# EAGLE design BusPirate-v3.6a-LTS-placed4-plane2-final (EAGLE 6.5.0)
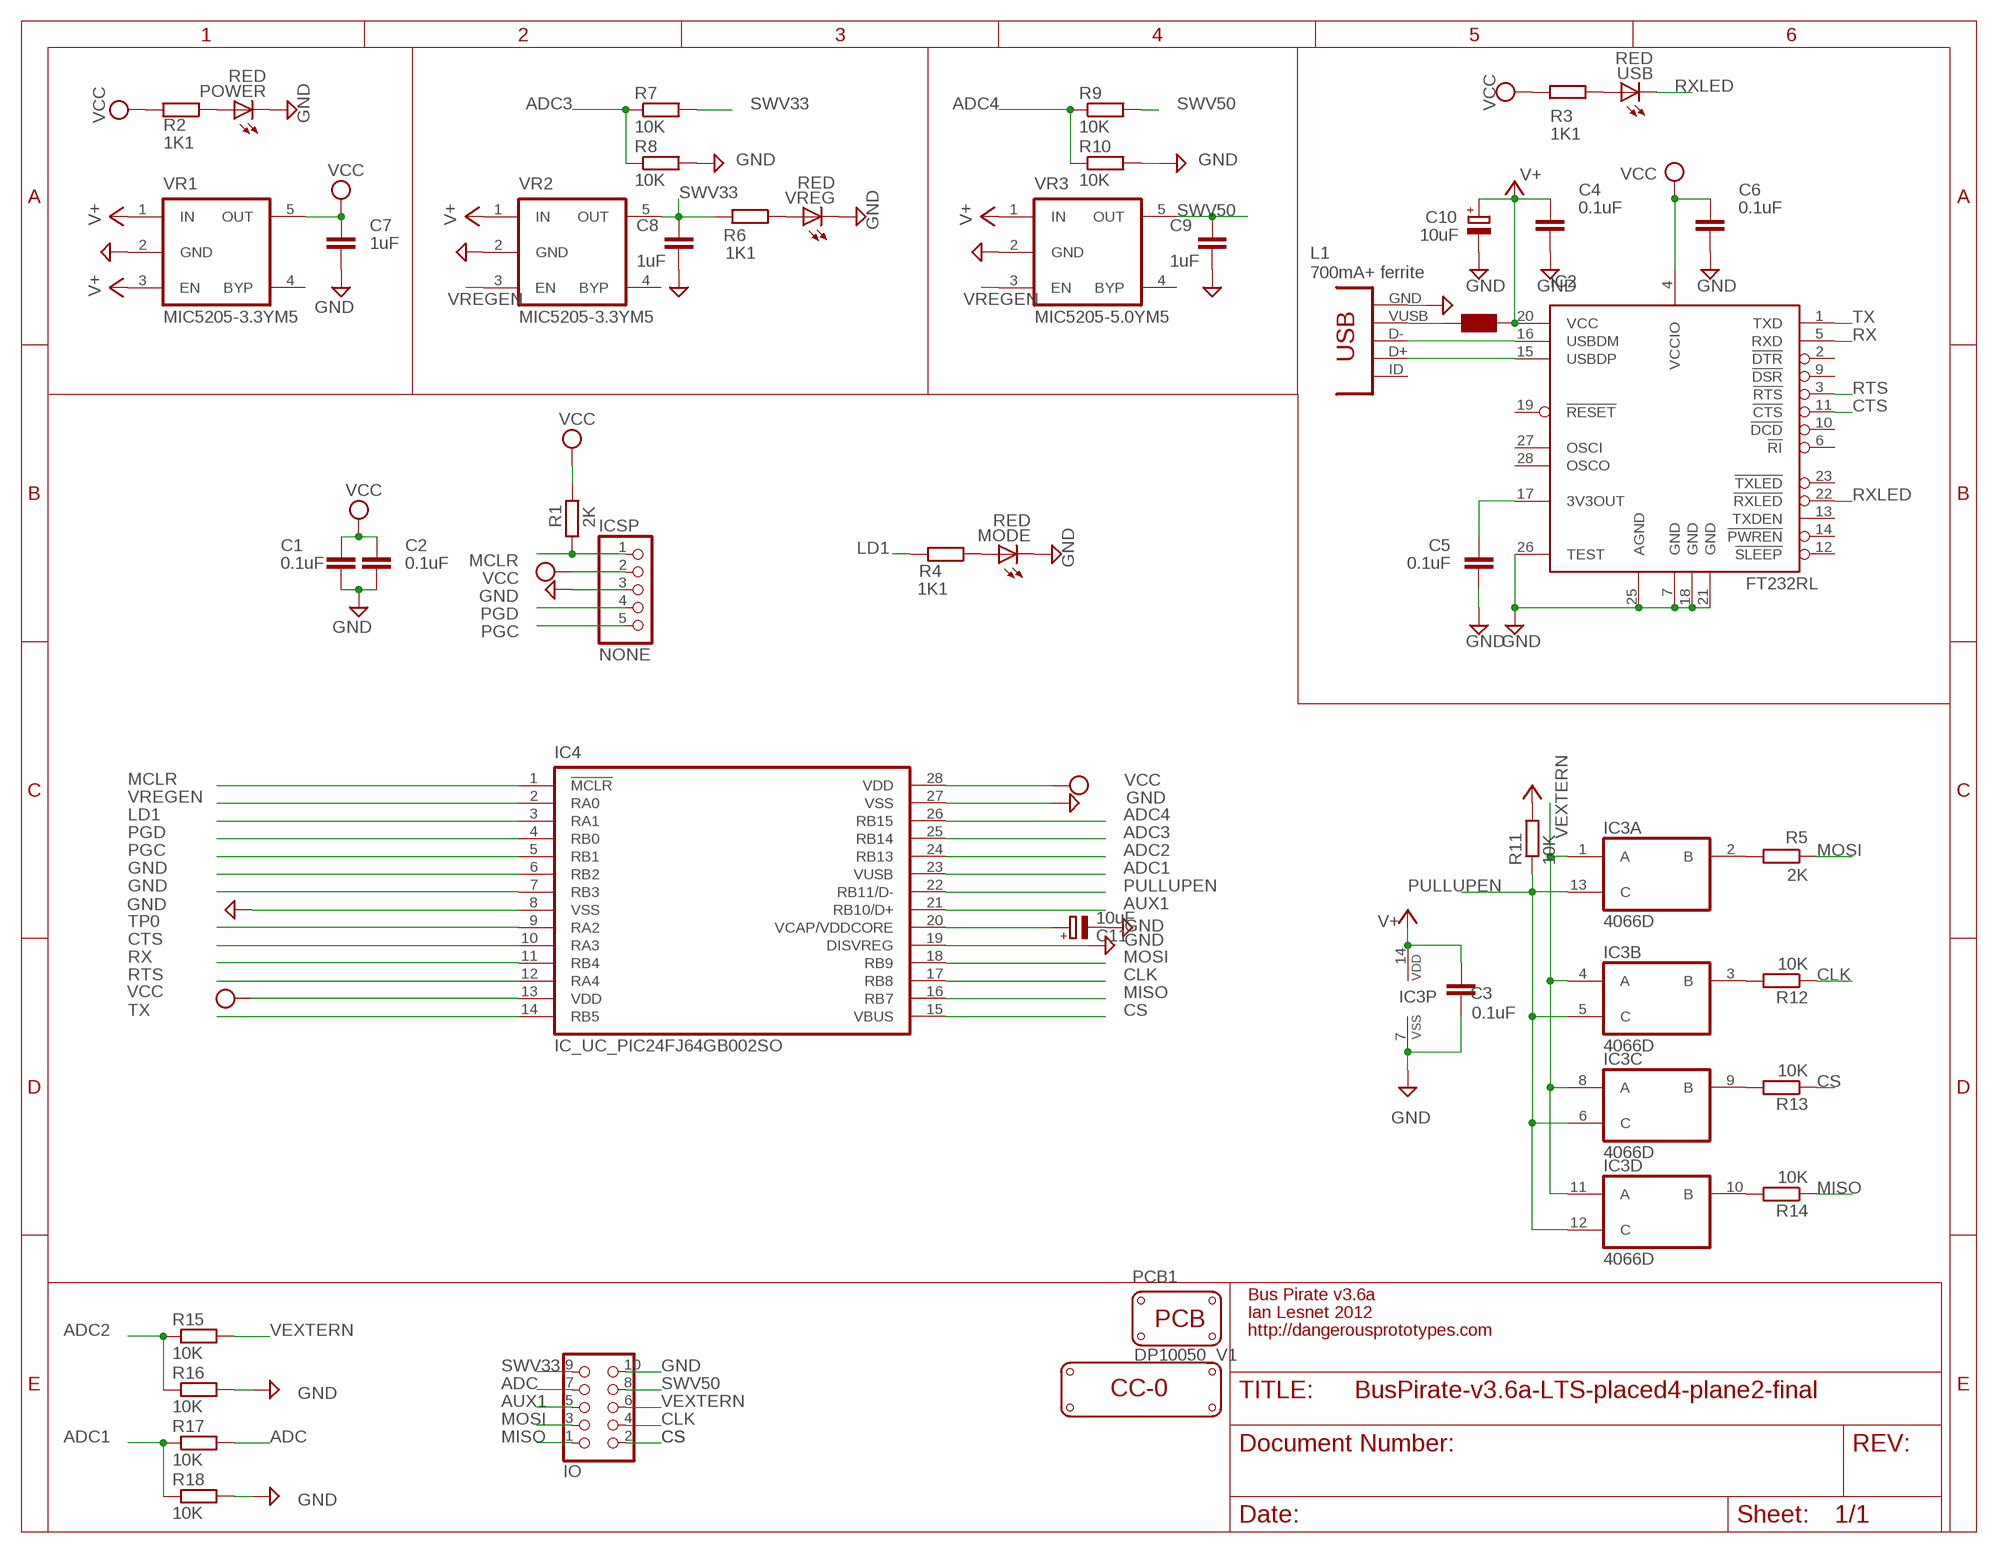
[diagram p0: schematic, sheet 1]

## Parts
C1  0.1uF  C-EUC1206  [C1206]
C2  0.1uF  C-EUC1206  [C1206]
C3  0.1uF  C-EUC1206  [C1206]
C4  0.1uF  C-EUC1206  [C1206]
C5  0.1uF  C-EUC1206  [C1206]
C6  0.1uF  C-EUC1206  [C1206]
C7  1uF  C-EUC1206  [C1206]
C8  1uF  C-EUC1206  [C1206]
C9  1uF  C-EUC1206  [C1206]
C10  10uF  CPOL-EUCT3528  [CT3528]
C11  10uF  CPOL-EUCT3528  [CT3528]
IC2  FT232RL  [SSOP28]
IC3  4066D  [SO14]
IC4  IC_UC_PIC24FJ64GB002SO  [SOIC-28W]
ICSP  NONE  PINHD-1X5  [1X05]
IO  CON_HEADER_2X05-PTH+SHROUDED_B  [PINSHRD_PTH_2X05B]
J1  CON-USB-MINI-BUSB1  [CONN_USB_MINI-B]
L1  700mA+ ferrite  WE-KIL_0805  [WE-KI_0805_B]
LOGO1  LOGO_CC-0  [LOGO_CC-0]
MODE  RED  LEDCHIPLED_1206  [CHIPLED_1206]
PCB1  PCB_DP_RECTANGLE-50X100  [DP10050_V1]
POWER  RED  LEDCHIPLED_1206  [CHIPLED_1206]
R1  2K  R-EU_R1206  [R1206]
R2  1K1  R-EU_R1206  [R1206]
R3  1K1  R-EU_R1206  [R1206]
R4  1K1  R-EU_R1206  [R1206]
R5  2K  R-EU_R1206  [R1206]
R6  1K1  R-EU_R1206  [R1206]
R7  10K  R-EU_R1206  [R1206]
R8  10K  R-EU_R1206  [R1206]
R9  10K  R-EU_R1206  [R1206]
R10  10K  R-EU_R1206  [R1206]
R11  10K  R-EU_R1206  [R1206]
R12  10K  R-EU_R1206  [R1206]
R13  10K  R-EU_R1206  [R1206]
R14  10K  R-EU_R1206  [R1206]
R15  10K  R-EU_R1206  [R1206]
R16  10K  R-EU_R1206  [R1206]
R17  10K  R-EU_R1206  [R1206]
R18  10K  R-EU_R1206  [R1206]
USB  RED  LEDCHIPLED_1206  [CHIPLED_1206]
VR1  MIC5205-3.3YM5  MIC5205  [SOT-23-5]
VR2  MIC5205-3.3YM5  MIC5205  [SOT-23-5]
VR3  MIC5205-5.0YM5  MIC5205  [SOT-23-5]
VREG  RED  LEDCHIPLED_1206  [CHIPLED_1206]

## Nets
$N26: J1.VUSB L1.2
ADC: IO.7 R17.2
ADC1: IC4.23(VUSB) R17.1 R18.1
ADC2: IC4.24(RB13) R15.1 R16.1
ADC3: IC4.25(RB14) R7.1 R8.1
ADC4: IC4.26(RB15) R9.1 R10.1
AUX1: IC4.21(RB10/D+) IO.5
CLK: IC4.17(RB8) IO.4 R12.1
CS: IC4.15(VBUS) IO.2 R13.1
CTS: IC2.11(!CTS) IC4.10(RA3)
GND: C1.2 C2.2 C3.2 C4.2 C5.2 C6.2 C7.2 C8.2 C9.2 C10.- C11.- IC2.7(GND) IC2.18(GND) IC2.21(GND) IC2.25(AGND) IC2.26(TEST) IC3.7(P:VSS) IC4.6(RB2) IC4.7(RB3) IC4.8(VSS) IC4.19(DISVREG) IC4.27(VSS) ICSP.3 IO.10 J1.GND MODE.C POWER.C R8.2 R10.2 R16.2 R18.2 VR1.2(GND) VR2.2(GND) VR3.2(GND) VREG.C
LD1: IC4.3(RA1) R4.2
MCLR: IC4.1(!MCLR) ICSP.1 R1.1
MISO: IC4.16(RB7) IO.1 R14.1
MOSI: IC4.18(RB9) IO.3 R5.1
N$1: IC3.2(A:B) R5.2
N$2: IC3.3(B:B) R12.2
N$3: C11.+ IC4.20(VCAP/VDDCORE)
N$4: IC3.9(C:B) R13.2
N$5: IC3.10(D:B) R14.2
N$6: MODE.A R4.1
N$7: POWER.A R2.1
N$9: C5.1 IC2.17(3V3OUT)
N$13: R3.1 USB.A
N$15: IC2.15(USBDP) J1.D+
N$16: IC2.16(USBDM) J1.D-
N$18: R6.1 VREG.A
PGC: IC4.5(RB1) ICSP.5
PGD: IC4.4(RB0) ICSP.4
PULLUPEN: IC3.5(B:C) IC3.6(C:C) IC3.12(D:C) IC3.13(A:C) IC4.22(RB11/D-) R11.1
RTS: IC2.3(!RTS) IC4.12(RA4)
RX: IC2.5(RXD) IC4.11(RB4)
RXLED: IC2.22(!RXLED) USB.C
SWV33: C8.1 IO.9 R6.2 R7.2 VR2.5(OUT)
SWV50: C9.1 IO.8 R9.2 VR3.5(OUT)
TP0: IC4.9(RA2)
TX: IC2.1(TXD) IC4.14(RB5)
V+: C3.1 C4.1 C10.+ IC2.20(VCC) IC3.14(P:VDD) L1.1 R11.2 VR1.1(IN) VR1.3(EN) VR2.1(IN) VR3.1(IN)
VCC: C1.1 C2.1 C6.1 C7.1 IC2.4(VCCIO) IC4.13(VDD) IC4.28(VDD) ICSP.2 R1.2 R2.2 R3.2 VR1.5(OUT)
VEXTERN: IC3.1(A:A) IC3.4(B:A) IC3.8(C:A) IC3.11(D:A) IO.6 R15.2
VREGEN: IC4.2(RA0) VR2.3(EN) VR3.3(EN)
Unconnected: IC2.2(!DTR) IC2.6(!RI) IC2.9(!DSR) IC2.10(!DCD) IC2.12(!SLEEP) IC2.13(TXDEN) IC2.14(!PWREN) IC2.19(!RESET) IC2.23(!TXLED) IC2.27(OSCI) IC2.28(OSCO) J1.BODY@1(BODY) J1.BODY@2(BODY) J1.BODY@3(BODY) J1.BODY@4(BODY) J1.ID(USBID) VR1.4(BYP) VR2.4(BYP) VR3.4(BYP)

## Notes on the sheet
- Bus Pirate v3.6a
- Ian Lesnet 2012
- http://dangerousprototypes.com

## Library data of the parts
C1-C9 = rcl:C-EU: CAPACITOR, European symbol
C10 C11 = rcl:CPOL-EU: POLARIZED CAPACITOR, European symbol
IC2 = dp_devices:FT232RL: USB to serial UART interface
IC3 = 40xx:4066: Quad bilateral ANALOG SWITCH
IC4 = dp_devices:IC_UC_PIC24FJ64GB002
ICSP = pinhead:PINHD-1X5: PIN HEADER
IO = dp_devices:CON_HEADER_2X05: 2x05 pin header
J1 = dp_devices:CON-USB-MINI-B: USB connector
L1 = wuerth-elektronik:WE-KIL: SMD Wire Wound Ceramic Inductor WE-KIL - Low profile - High Q values -- Bluetooth -- Wireless LAN -- RF oscillation circuit -- IF impedance matching
LOGO1 = dp_devices:LOGO_CC-0
MODE POWER USB VREG = led:LED: LED OSRAM: - CHIPLED LG R971, LG N971, LY N971, LG Q971, LY Q971, LO R971, LY R971 LH N974, LH R974 LS Q976, LO Q976, LY Q976 LO Q996 - Hyper CHIPLED LW Q18S LB Q993, LB Q99A, LB R99A - SideLED LS A670, LO A670, LY A670, LG A670, LP A670 LB A673, LV A673, LT A673, LW A673 LH A674 LY A675 LS A676, LA A676, LO A676, LY A676, LW A676 LS A679, LY A679, LG A679 - Hyper Micro SIDELED® LS Y876, LA Y876, LO Y876, LY Y876 LT Y87S - SmartLED LW L88C, LW L88S LB L89C, LB L89S, LG L890 LS L89K, LO L89K, LY L89K LS L896, LA L896, LO L896, LY L896 - TOPLED LS T670, LO T670, LY T670, LG T670, LP T670 LSG T670, LSP T670, LSY T670, LOP T670, LYG T670 LG T671, LOG T671, LSG T671 LB T673, LV T673, LT T673, LW T673 LH T674 LS T676, LA T676, LO T676, LY T676, LB T676, LH T676, LSB T676, LW T676 LB T67C, LV T67C, LT T67C, LS T67K, LO T67K, LY T67K, LW E67C LS E67B, LA E67B, LO E67B, LY E67B, LB E67C, LV E67C, LT E67C LW T67C LS T679, LY T679, LG T679 LS T770, LO T770, LY T770, LG T770, LP T770 LB T773, LV T773, LT T773, LW T773 LH T774 LS E675, LA E675, LY E675, LS T675 LS T776, LA T776, LO T776, LY T776, LB T776 LHGB T686 LT T68C, LB T68C - Hyper Mini TOPLED® LB M676 - Mini TOPLED Santana® LG M470 LS M47K, LO M47K, LY M47K Source: http://www.osram.convergy.de LUXEON: - LUMILED® LXK2-PW12-R00, LXK2-PW12-S00, LXK2-PW14-U00, LXK2-PW14-V00 LXK2-PM12-R00, LXK2-PM12-S00, LXK2-PM14-U00 LXK2-PE12-Q00, LXK2-PE12-R00, LXK2-PE12-S00, LXK2-PE14-T00, LXK2-PE14-U00 LXK2-PB12-K00, LXK2-PB12-L00, LXK2-PB12-M00, LXK2-PB14-N00, LXK2-PB14-P00, LXK2-PB14-Q00 LXK2-PR12-L00, LXK2-PR12-M00, LXK2-PR14-Q00, LXK2-PR14-R00 LXK2-PD12-Q00, LXK2-PD12-R00, LXK2-PD12-S00 LXK2-PH12-R00, LXK2-PH12-S00 LXK2-PL12-P00, LXK2-PL12-Q00, LXK2-PL12-R00 Source: www.luxeon.com KINGBRIGHT: KA-3528ASYC Source: www.kingbright.com
PCB1 = dp_devices:PCB_DP_RECTANGLE: Dangerous Prototypes Standard Rectangular PCB sizes; PCB_SIZE: DP10050_V1
R1-R18 = rcl:R-EU_: RESISTOR, European symbol
VR1-VR3 = dp_devices:MIC5205: 150ma Low-Noise LDO Regulator

## Board
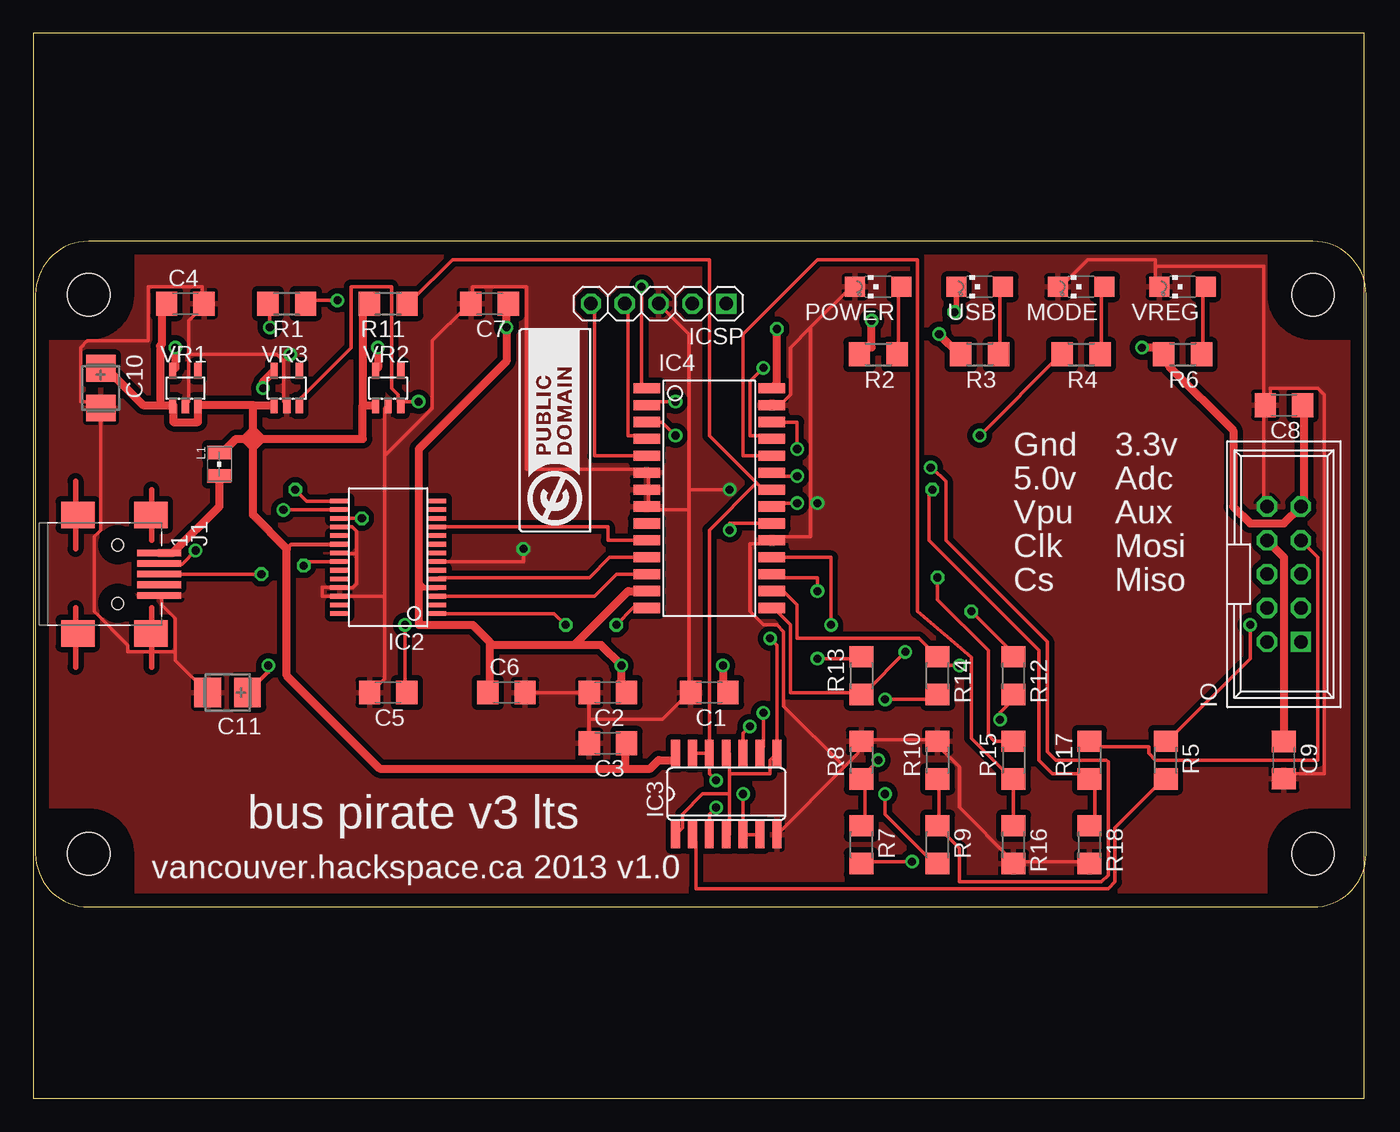
[diagram p1: board, top side]
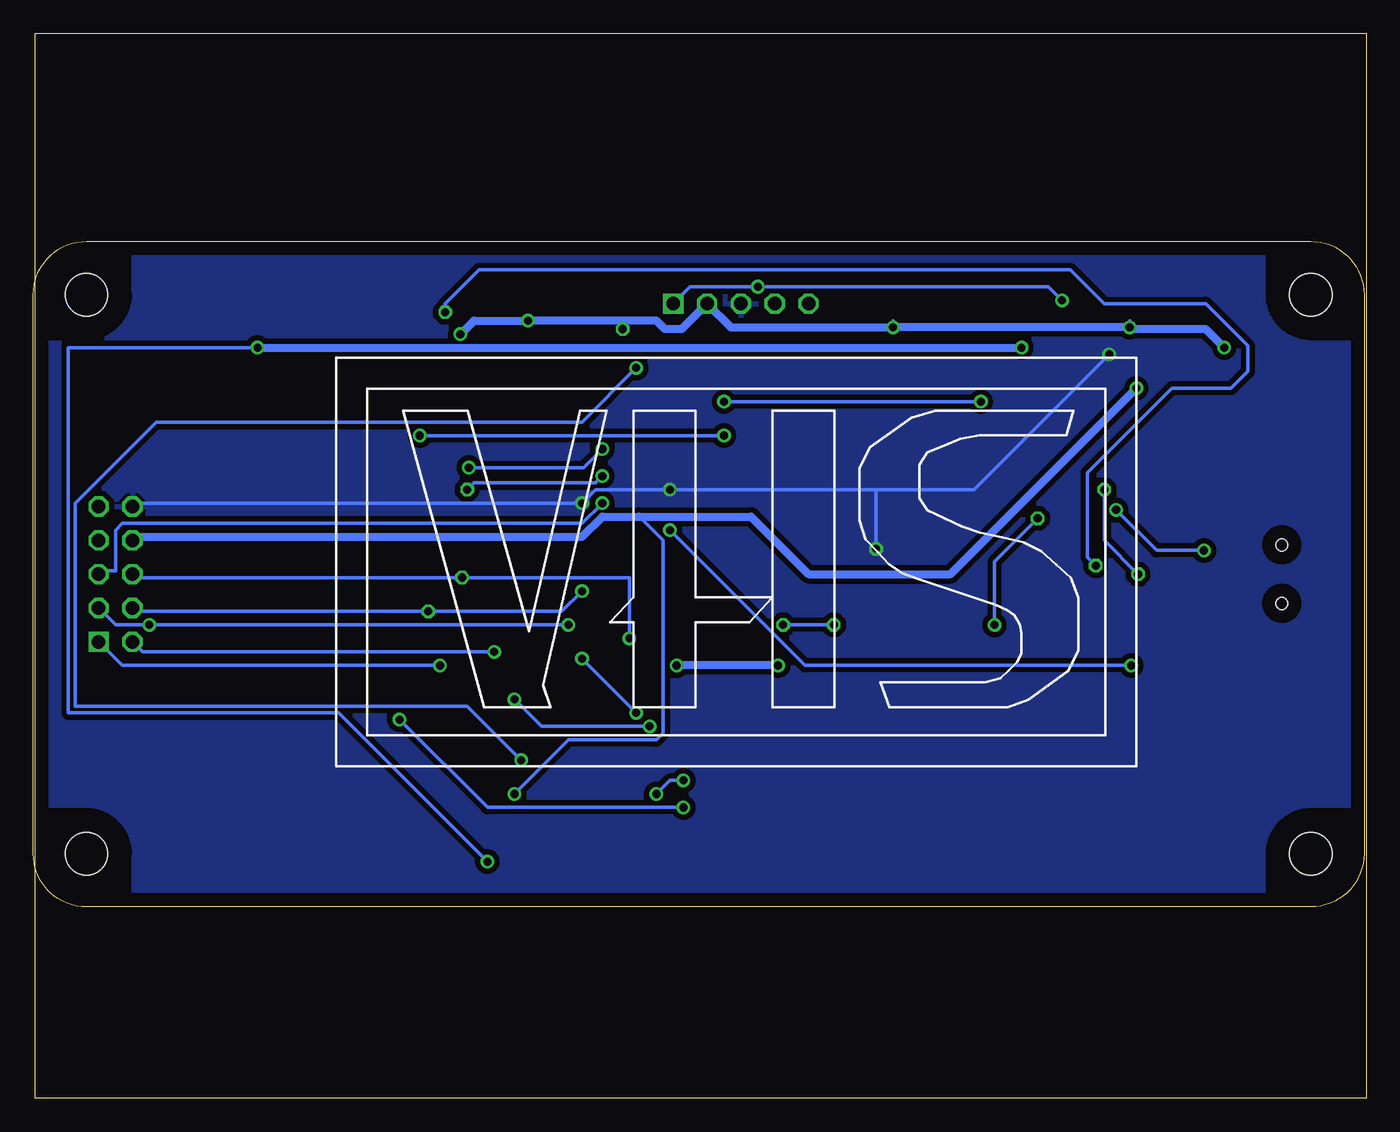
[diagram p2: board, bottom side, seen from below]

Size 100 x 80 mm. Coordinates in mm from the lower left corner, seen from the top.
Outline: 0,0 100,0 100,80 0,80 0,0
Copper layers (1*16): Top 0.035mm / dielectric 1.5mm / Bottom 0.035mm
Design rules "default": minimum track width 10mil, minimum drill 24mil, track to track 8mil, track to pad 8mil, pad to pad 8mil, via to via 8mil, smd to smd 8mil, copper to edge 40mil, drill to drill 8mil, minimum pad ring 10mil, minimum via ring 8mil, stop-mask expansion 4mil, vias tented up to drill 0mil, thermal gap 10mil

### Footprints (pad centres in the part's own frame; a part is rotated, then mirrored left to right if it is on the bottom)
C1206 = smd 1.6 x 1.8: 1 -1.4,0; 2 1.4,0
CT3528 = smd 2 x 2.2: + -1.5,0; - 1.5,0
SSOP28 = smd 0.348 x 1.397: 1 -4.225,-3.656; 2 -3.575,-3.656; 3 -2.925,-3.656; 4 -2.275,-3.656; 5 -1.625,-3.656; 6 -0.975,-3.656; 7 -0.325,-3.656; 8 0.325,-3.656; 9 0.975,-3.656; 10 1.625,-3.656; 11 2.275,-3.656; 12 2.925,-3.656; 13 3.575,-3.656; 14 4.225,-3.656; 15 4.225,3.656; 16 3.575,3.656; 17 2.925,3.656; 18 2.275,3.656; 19 1.625,3.656; 20 0.975,3.656; 21 0.325,3.656; 22 -0.325,3.656; 23 -0.975,3.656; 24 -1.625,3.656; 25 -2.275,3.656; 26 -2.925,3.656; 27 -3.575,3.656; 28 -4.225,3.656
SO14 = smd 0.66 x 2.032: 1 -3.81,-3.073; 2 -2.54,-3.073; 3 -1.27,-3.073; 4 0,-3.073; 5 1.27,-3.073; 6 2.54,-3.073; 7 3.81,-3.073; 8 3.81,3.073; 9 2.54,3.073; 10 1.27,3.073; 11 0,3.073; 12 -1.27,3.073; 13 -2.54,3.073; 14 -3.81,3.073
SOIC-28W = smd 0.762 x 2: 1 -8.89,-4.7; 2 -7.62,-4.7; 3 -6.35,-4.7; 4 -5.08,-4.7; 5 -3.81,-4.7; 6 -2.54,-4.7; 7 -1.27,-4.7; 8 0,-4.7; 9 1.27,-4.7; 10 2.54,-4.7; 11 3.81,-4.7; 12 5.08,-4.7; 13 6.35,-4.7; 14 7.62,-4.7; 15 7.62,4.7; 16 6.35,4.7; 17 5.08,4.7; 18 3.81,4.7; 19 2.54,4.7; 20 1.27,4.7; 21 0,4.7; 22 -1.27,4.7; 23 -2.54,4.7; 24 -3.81,4.7; 25 -5.08,4.7; 26 -6.35,4.7; 27 -7.62,4.7; 28 -8.89,4.7
1X05 = drill 1.016 square: 1 -5.08,0 | drill 1.016 octagon: 2 -2.54,0; 3 0,0; 4 2.54,0; 5 5.08,0
PINSHRD_PTH_2X05B = drill 1.016 square: 1 -5.08,-1.27 | drill 1.016 octagon: 2 -5.08,1.27; 3 -2.54,-1.27; 4 -2.54,1.27; 5 0,-1.27; 6 0,1.27; 7 2.54,-1.27; 8 2.54,1.27; 9 5.08,-1.27; 10 5.08,1.27
CONN_USB_MINI-B = smd 2 x 2.5: BODY@1 -4.45,2.5; BODY@2 4.45,2.5; BODY@3 4.45,-3; BODY@4 -4.45,-3 | smd 0.5 x 3.3: D+ 0,3.1; D- -0.8,3.1; GND 1.6,3.1; ID 0.8,3.1; VUSB -1.6,3.1 | hole 0.9: -2.2,0; 2.2,0
WE-KI_0805_B = smd 1.02 x 1.78: 1 -0.89,0; 2 0.89,0
CHIPLED_1206 = smd 1.5 x 1.5: A 0,-1.75; C 0,1.75
DP10050_V1 = hole 3.2: -46,-21; 46,-21; 46,21; -46,21
R1206 = smd 1.6 x 1.803: 1 -1.422,0; 2 1.422,0
SOT-23-5 = smd 0.55 x 1.2: 1 -0.95,-1.3; 2 0,-1.3; 3 0.95,-1.3; 4 0.95,1.3; 5 -0.95,1.3

### Placement (x,y rotation side)
C1  50.8,30.48 180 top
C2  43.18,30.48 180 top
C3  43.18,26.67 180 top
C4  11.43,59.69 0 top
C5  26.67,30.48 180 top
C6  35.56,30.48 0 top
C7  34.29,59.69 180 top
C8  93.98,52.07 180 top
C9  93.98,25.4 270 top
C10  5.08,53.34 270 top
C11  14.61,30.48 180 top
IC2  26.67,40.64 90 top
IC3  52.07,22.86 0 top
IC4  50.8,44.45 270 top
ICSP  46.99,59.69 180 top
IO  93.98,39.37 90 top
J1  6.35,39.37 270 top
L1  13.97,47.62 270 top
LOGO1  41.88,42.52 90 top
MODE  78.74,60.96 90 top
PCB1  50.16,39.37 0 top
POWER  63.5,60.96 90 top
R1  19.05,59.69 180 top
R2  63.5,55.88 180 top
R3  71.12,55.88 180 top
R4  78.74,55.88 180 top
R5  85.09,25.4 270 top
R6  86.36,55.88 180 top
R7  62.23,19.05 270 top
R8  62.23,25.4 90 top
R9  67.94,19.05 270 top
R10  67.94,25.4 90 top
R11  26.67,59.69 180 top
R12  73.66,31.75 270 top
R13  62.23,31.75 90 top
R14  67.94,31.75 270 top
R15  73.66,25.4 90 top
R16  73.66,19.05 270 top
R17  79.38,25.4 90 top
R18  79.38,19.05 270 top
U$1  [VHS]  47.22,40.3 0 bottom
USB  71.12,60.96 90 top
VR1  11.43,53.34 0 top
VR2  26.67,53.34 0 top
VR3  19.05,53.34 0 top
VREG  86.36,60.96 90 top

### Tracks (layer width: path | path; a pad name or v marks a point on that pad's centre or on a via)
$N26
  Top 0.61: J1.VUSB 10.49,40.97 13.97,44.45 L1.2
ADC
  Top 0.254: IO.7 96.52,40.64 96.52,25.4 84.33,25.4 83.82,25.91 83.82,26.42 79.76,26.42 R17.2
ADC1  (via drill 0.61)
  Top 0.254: R18.1 79.76,20.83 79.76,23.6 R17.1 | 79.76,23.88 R17.1 | v57.4,46.74 55.88,46.74 IC4.23 | R17.1 79.25,24.38 76.58,24.38 75.56,25.4 75.56,33.66 67.31,41.91 67.31,45.47 v67.56,45.72
  Bottom 0.254: v57.4,46.74 57.91,46.23 67.06,46.23 v67.56,45.72
ADC2
  Top 0.254: 73.66,23.88 R16.1 | IC4.24 53.34,48.26 53.34,57.4 58.93,62.99 66.42,62.99 66.42,36.58 70.48,33.15 70.48,27.05 73.66,23.88 | 73.66,23.88 R15.1
ADC3  (via drill 0.61)
  Top 0.254: R7.1 62.48,20.83 62.48,23.88 R8.1 62.48,24.38 v63.5,25.4 | v54.86,54.86 53.85,53.85 53.85,49.78 55.37,49.78 IC4.25
  Bottom 0.254: v54.86,54.86 58.93,50.8 90.93,50.8 97.03,44.7 97.03,29.46 67.56,29.46 v63.5,25.4
ADC4  (via drill 0.61)
  Top 0.254: R10.1 68.07,23.88 68.07,20.83 R9.1 68.07,20.32 69.6,18.8 69.6,16.26 80.26,16.26 80.77,16.76 80.77,25.27 80.64,25.4 76.83,25.4 76.2,26.04 76.2,34.29 68.58,41.91 68.58,46.35 68.2,46.74 v67.44,47.37 | IC4.26 57.4,50.8 v57.4,48.77
  Bottom 0.254: v57.4,48.77 58.8,47.37 v67.44,47.37
AUX1  (via drill 0.61)
  Top 0.254: v57.4,44.7 55.88,44.7 IC4.21
  Bottom 0.254: v57.4,44.7 58.93,43.18 93.47,43.18 93.98,42.67 93.98,39.62 95,39.62 IO.5
CLK  (via drill 0.61)
  Top 0.254: R12.1 73.66,33.53 73.53,33.53 v70.48,36.58 | v58.93,38.1 58.93,39.12 55.88,39.12 IC4.17
  Bottom 0.254: IO.4 92.46,36.58 71.12,36.58 v70.48,36.58 60.45,36.58 v58.93,38.1
CS  (via drill 0.61)
  Top 0.254: IC4.15 55.88,36.58 56.9,35.56 56.9,30.48 61.98,30.48 R13.1 62.48,30.48 v65.53,33.53
  Bottom 0.254: IO.2 91.95,33.53 v65.53,33.53
CTS
  Top 0.254: IC2.11 43.18,42.91 43.18,41.91 IC4.10
GND  (via drill 0.61)
  Top 0.254: 11.68,55.88 11.68,58.42 12.7,59.44 C4.2 12.7,59.94 12.7,60.96 8.64,60.96 8.64,56.9 4.06,56.9 3.56,56.39 3.56,52.32 5.08,52.32 C10.- 5.08,42.67 4.57,42.16 4.57,36.58 7.11,34.04 7.11,33.53 10.67,33.53 | 11.68,55.88 11.68,52.32 VR1.2 | 18.8,55.37 18.8,52.32 VR3.2 | 18.8,55.37 18.29,55.88 11.68,55.88 | J1.GND 9.65,37.59 9.65,37.08 10.67,36.07 10.67,33.53 | 46.23,45.72 46.23,44.7 IC4.8 46.23,44.2 49.28,44.2 | 46.23,45.72 46.23,46.74 IC4.6 45.72,47.24 37.08,47.24 37.08,60.96 33.02,60.96 33.02,59.94 C7.2 32.51,59.44 29.97,56.9 29.97,51.82 26.42,48.26 | 46.23,45.72 IC4.7 | 42.16,30.48 C2.2 | 49.28,30.48 49.28,44.2 | 49.28,30.48 C1.2 | ICSP.3 49.28,57.4 49.28,45.72 | 49.28,44.2 49.28,45.72 | 26.42,37.72 26.42,31.5 25.4,30.48 C5.2 | 26.42,37.72 26.42,48.26 | 26.42,48.26 26.42,51.82 VR2.2 | 84.33,62.48 84.33,60.96 VREG.C | 84.33,62.48 84.33,62.99 79.25,62.99 77.22,60.96 MODE.C | C8.2 92.46,51.82 92.46,44.7 IO.10 | C9.2 93.98,24.38 97.03,24.38 97.03,52.83 96.52,53.34 92.96,53.34 92.96,52.32 C8.2 | 84.33,62.48 92.46,62.48 92.46,52.32 C8.2 | 58.42,57.91 56.9,56.39 56.9,52.83 55.88,51.82 IC4.27 | 58.42,57.91 61.47,60.96 POWER.C | 58.42,57.91 58.42,44.7 | 58.42,44.7 58.42,42.16 55.88,42.16 IC4.19 55.37,41.66 53.85,41.66 53.85,36.58 54.86,35.56 55.88,35.56 56.39,35.05 56.39,29.46 60.96,24.89 | 73.66,17.78 79.25,17.78 R18.2 | 60.96,24.89 61.98,25.91 61.98,26.42 R8.2 62.48,26.92 67.56,26.92 R10.2 68.07,26.42 69.6,24.89 69.6,21.84 73.66,17.78 | 60.96,24.89 55.88,19.81 IC3.7 | 73.66,17.78 R16.2 | 58.42,44.7 v58.93,44.7 | v52.32,45.72 49.28,45.72 | v19.3,55.88 18.8,55.37 | IC2.7 36.83,40.31 v36.83,41.27
  Top 0.254: 10.67,33.53 10.67,32.92 C11.- | IC2.18 23.96,42.91 24.28,42.6 24.28,40.92 | 24.28,40.92 24.28,38.63 24.01,38.37 IC2.25 21.69,38.38 21.69,37.72 21.7,37.72 IC2.26 26.42,37.72 | IC2.21 23.06,40.92 24.28,40.92 | C6.2 C2.2 | C3.2 41.78,28.47 | 41.78,28.47 C2.2 | 49.28,30.48 47.27,28.47 41.78,28.47
  Bottom 0.254: IO.10 92.46,44.7 v58.93,44.7 57.91,45.72 v52.32,45.72 36.83,45.72 | v19.3,55.88 29.46,45.72 36.83,45.72 | v36.83,41.27 36.83,45.72
  pour Bottom (isolate 0.406): -1.73,65.57 102.13,65.57 102.13,9.82 -1.73,9.82 -1.73,65.57
  pour Top (isolate 0.406): -4.58,67.96 103.59,67.96 103.59,9.77 -4.6,9.77 -4.6,68
LD1  (via drill 0.61)
  Top 0.254: v71.12,49.78 77.22,55.88 R4.2 | v48.26,49.78 47.24,50.8 IC4.3
  Bottom 0.254: v48.26,49.78 v71.12,49.78
MCLR  (via drill 0.61)
  Top 0.254: v22.86,59.94 20.83,59.94 R1.1 | v45.72,60.96 45.72,53.34 IC4.1
  Bottom 0.254: v22.86,59.94 23.88,60.96 v45.72,60.96 50.8,60.96 ICSP.1
MISO  (via drill 0.61)
  Top 0.254: IC4.16 56.39,38.1 57.4,37.08 57.4,34.54 66.55,34.54 67.56,33.53 R14.1 68.07,33.02 68.07,32.51 v69.6,32.51
  Bottom 0.254: IO.1 93.47,32.51 v69.6,32.51
MOSI  (via drill 0.61)
  Top 0.254: v91.44,35.56 91.44,33.02 85.34,26.92 R5.1 | IC4.18 59.94,40.64 v59.94,35.56
  Bottom 0.254: IO.3 93.98,35.56 v91.44,35.56 v59.94,35.56
N$1
  Top 0.254: R5.2 84.84,23.88 81.28,20.32 81.28,16.26 80.77,15.75 49.78,15.75 49.78,19.3 IC3.2
N$2  (via drill 0.61)
  Top 0.254: v72.64,28.45 72.64,28.96 73.66,29.97 R12.2 | v51.31,21.84 50.8,21.34 IC3.3
  Bottom 0.254: v72.64,28.45 66.04,21.84 v51.31,21.84
N$3  (via drill 0.61)
  Top 0.254: IC4.20 52.32,43.18 v52.32,42.67
  Top 0.305: C11.+ 17.65,32.03 v17.65,32.51
  Bottom 0.254: v52.32,42.67 42.16,32.51 v17.65,32.51
N$4  (via drill 0.61)
  Top 0.254: v58.93,33.02 61.98,33.02 R13.2 | v54.86,28.96 54.86,26.42 IC3.9
  Bottom 0.254: v54.86,28.96 v58.93,33.02
N$5  (via drill 0.61)
  Top 0.254: v64.01,29.97 67.56,29.97 R14.2 | v53.85,27.94 53.34,27.43 IC3.10
  Bottom 0.254: v64.01,29.97 61.98,27.94 v53.85,27.94
N$6
  Top 0.254: MODE.A 80.26,60.96 80.26,55.88 R4.1
N$7
  Top 0.254: POWER.A 65.02,60.96 65.02,55.88 R2.1
N$8
  Top 0.406: 3.17,46.35 3.17,41.27
N$9  (via drill 0.61)
  Top 0.254: v27.94,35.56 27.94,30.48 C5.1 | v24.69,43.56 IC2.17
  Bottom 0.254: v24.69,43.56 27.94,40.31 v27.94,35.56
N$10
  Top 0.406: 3.17,36.83 3.17,32.38
N$11
  Top 0.406: 8.89,32.38 8.89,36.83
N$12
  Top 0.406: 8.89,41.91 8.89,45.72
N$13
  Top 0.254: USB.A 72.64,60.96 72.64,55.88 R3.1
N$15  (via drill 0.61)
  Top 0.254: J1.D+ v17.14,39.37 | v19.68,45.72 20.54,44.87 IC2.15
  Bottom 0.254: v17.14,39.37 19.68,41.91 v19.68,45.72
N$16  (via drill 0.61)
  Top 0.254: v18.8,44.2 22.86,44.2 IC2.16 | v12.19,41.15 11.18,40.13 9.65,40.13 J1.D-
  Bottom 0.254: v18.8,44.2 15.75,41.15 v12.19,41.15
N$18
  Top 0.254: VREG.A 87.88,60.96 87.88,55.88 R6.1
PGC
  Top 0.254: IC4.5 42.16,48.26 42.16,59.44 ICSP.5
PGD
  Top 0.254: IC4.4 45.72,49.78 44.7,49.78 44.7,59.44 ICSP.4
PULLUPEN  (via drill 0.61)
  Top 0.254: 53.34,19.81 54.36,19.81 IC3.6 | 50.8,25.91 49.78,25.91 IC3.13 | 54.36,46.23 54.86,45.72 IC4.22 | 54.36,46.23 50.8,49.78 50.8,62.99 31.5,62.99 28.45,59.94 R11.1 | 54.36,46.23 50.8,42.67 IC3.12 50.8,25.91 | v53.34,22.86 53.34,19.81 | v51.31,23.88 50.8,24.38 50.8,25.91 | 53.34,19.81 IC3.5
  Bottom 0.254: v53.34,22.86 52.32,23.88 v51.31,23.88
RTS
  Top 0.254: IC2.3 42.16,37.72 43.81,39.37 IC4.12
RX
  Top 0.254: IC4.11 43.31,40.64 41.78,39.12 30.48,39.12 IC2.5
RXLED  (via drill 0.61)
  Top 0.254: IC2.22 20.63,40.31 v20.32,40.01
  Top 0.406: USB.C 69.37,59.21 v69.22,59.05
  Bottom 0.254: v69.22,59.05 69.22,59.69 66.67,62.23 22.23,62.23 19.68,59.69 12.06,59.69 8.89,56.52 8.89,54.61 10.16,53.34 14.61,53.34 20.95,46.99 20.95,40.64 v20.32,40.01
SWV33  (via drill 0.61)
  Top 0.254: 95.5,51.82 C8.1 | 95.5,44.7 IO.9 | 84.84,56.39 84.84,55.88 R6.2 85.34,55.88 | 25.91,54.86 VR2.5 | v66.04,17.78 62.48,17.78 R7.2
  Top 0.61: 95.5,44.7 95.5,51.82 | v25.91,56.39 25.91,54.86 | 84.84,56.39 v83.31,56.39 | IO.9 93.98,43.18 91.44,43.18 90.17,44.45 90.17,50.16 85.34,54.99 85.34,55.88
  Bottom 0.254: v66.04,17.78 77.22,28.96 97.54,28.96 97.54,56.39 v83.31,56.39
  Bottom 0.61: v83.31,56.39 v25.91,56.39
SWV50  (via drill 0.61)
  Top 0.254: v64.01,22.86 64.01,21.34 67.56,17.78 R9.2 | 18.12,54.52 18.12,54.66 18.11,54.65 18.11,54.52 18.11,54.42
  Top 0.406: VR3.5 18.11,54.64 18.11,54.52
  Top 0.61: C9.1 93.98,40.64 IO.8 | v17.27,53.34 17.27,53.81 VR3.5
  Bottom 0.254: 92.46,42.16 IO.8 | v64.01,22.86 59.94,26.92 53.34,26.92 52.83,27.43 52.83,41.91 54.61,43.69
  Bottom 0.61: 92.46,42.16 58.93,42.16 57.4,43.69 54.61,43.69 46.23,43.69 41.91,39.37 31.24,39.37 v17.27,53.34
TX  (via drill 0.61)
  Top 0.254: IC2.1 39.15,36.41 v40.01,35.56 | v43.81,35.56 45.09,36.83 IC4.14
  Bottom 0.254: v40.01,35.56 v43.81,35.56
V+
  Top 0.254: 9.65,59.44 C4.1 | 5.08,54.86 C10.+ | 22.86,41.66 IC2.20 | 48.26,25.4 IC3.14 | 25.69,52.07 25.72,52.07 VR2.1
  Top 0.305: 19.05,41.27 19.39,41.62 IC2.20
  Top 0.61: L1.1 14.22,48.52 15.24,49.53 16.51,49.53 | 16.51,49.53 16.51,50.16 | 16.51,50.16 16.51,52.07 | 16.51,52.07 12.41,52.07 VR1.3 12.38,50.85 12.37,50.85 12.37,50.8 10.52,50.8 10.52,52.04 VR1.1 10.45,52.07 9.53,52.07 | 16.51,52.07 18.07,52.07 VR3.1 | 16.51,49.53 17.14,49.53 | 17.14,49.53 24.77,49.53 24.77,52.07 | 24.77,52.07 25.69,52.07 | R11.2 25.25,59.54 24.77,59.05 24.77,52.07 | C10.+ 5.49,54.84 8.26,52.07 9.53,52.07 | 9.65,59.44 9.65,56.64 9.53,56.52 9.53,52.07 | 16.51,48.9 16.51,43.81 19.05,41.27 19.05,31.75 26.04,24.77 44.45,24.77 | 16.51,48.9 16.51,49.53 | 16.51,48.9 17.14,49.53 | 17.14,49.53 16.51,50.16 | 16.51,50.16 15.88,49.53 16.51,48.9 | 44.45,24.77 46.35,24.77 46.99,25.4 48.26,25.4 | C3.1 44.45,26.54 44.45,24.77
VCC  (via drill 0.61)
  Top 0.254: 44.2,30.48 C2.1 44.7,30.48 | 51.82,30.48 C1.1 | 62.99,56.39 62.48,55.88 R2.2 | 55.88,53.34 IC4.28 | 10.67,54.86 VR1.5 | 35.56,59.44 C7.1 | v17.78,57.91 17.78,59.44 R1.2 | 69.6,55.88 R3.2 | 34.29,30.61 C6.1 | 34.54,34.04 34.29,34.29
  Top 0.406: IC2.4 29.33,38.37 28.96,38.73
  Top 0.61: 44.2,30.48 v44.2,32.51 42.67,34.04 40.64,34.04 | v51.82,32.51 51.82,30.48 | IC4.13 44.7,38.1 40.64,34.04 | v10.67,56.39 10.67,54.86 | 35.56,59.44 v35.56,57.91 35.56,55.37 28.96,48.77 28.96,38.73 28.96,35.56 33.02,35.56 34.29,34.29 34.29,30.61 | v68.07,57.4 69.6,55.88 | 40.64,34.04 34.54,34.04 | 62.99,56.39 v62.99,58.42 | IC4.28 55.88,53.72 v55.88,57.78
  Bottom 0.254: 35.56,58.42 v35.56,57.91 | 17.78,58.42 v17.78,57.91
  Bottom 0.61: v44.2,32.51 v51.82,32.51 | v10.67,56.39 12.06,57.78 17.65,57.78 v17.78,57.91 v35.56,57.91 47.75,57.91 ICSP.2 51.44,57.78 52.7,57.78 53.34,58.42 55.88,58.42 | v68.07,57.4 67.06,58.42 v62.99,58.42 55.88,58.42 | v55.88,57.78 55.88,58.42
VEXTERN  (via drill 0.61)
  Top 0.254: 52.32,22.86 50.29,22.86 48.77,21.34 48.77,20.32 48.26,19.81 IC3.1 | 52.32,24.38 52.32,25.91 IC3.11 | 52.32,24.38 52.32,22.86 | 52.32,22.86 52.32,19.81 IC3.4 | 52.32,24.38 55.37,24.38 55.37,25.4 55.88,25.91 IC3.8 55.88,34.04 v55.37,34.54 | 73.66,26.92 R15.2 72.24,26.82 71.75,27.3 71.75,33.66 67.94,37.47 v67.94,39.12
  Bottom 0.254: IO.6 92.46,39.12 v67.94,39.12 55.37,39.12 v55.37,34.54
VREGEN  (via drill 0.61)
  Top 0.254: 27.43,52.32 27.43,52.83 26.92,53.34 26.92,60.96 23.88,60.96 23.88,56.39 19.81,52.32 VR3.3 | v48.26,52.32 46.23,52.32 IC4.2 | 27.43,52.32 v28.96,52.32 | 27.43,52.32 VR2.3
  Bottom 0.254: v28.96,52.32 v48.26,52.32

### Text on the board
tPlace: Gnd | 3.3v | 5.0v | Adc | Vpu | Aux | Clk | Mosi | Cs | Miso | bus pirate v3 lts | vancouver.hackspace.ca 2013 v1.0